# EAGLE design DispenGSM (EAGLE 9.6.2)
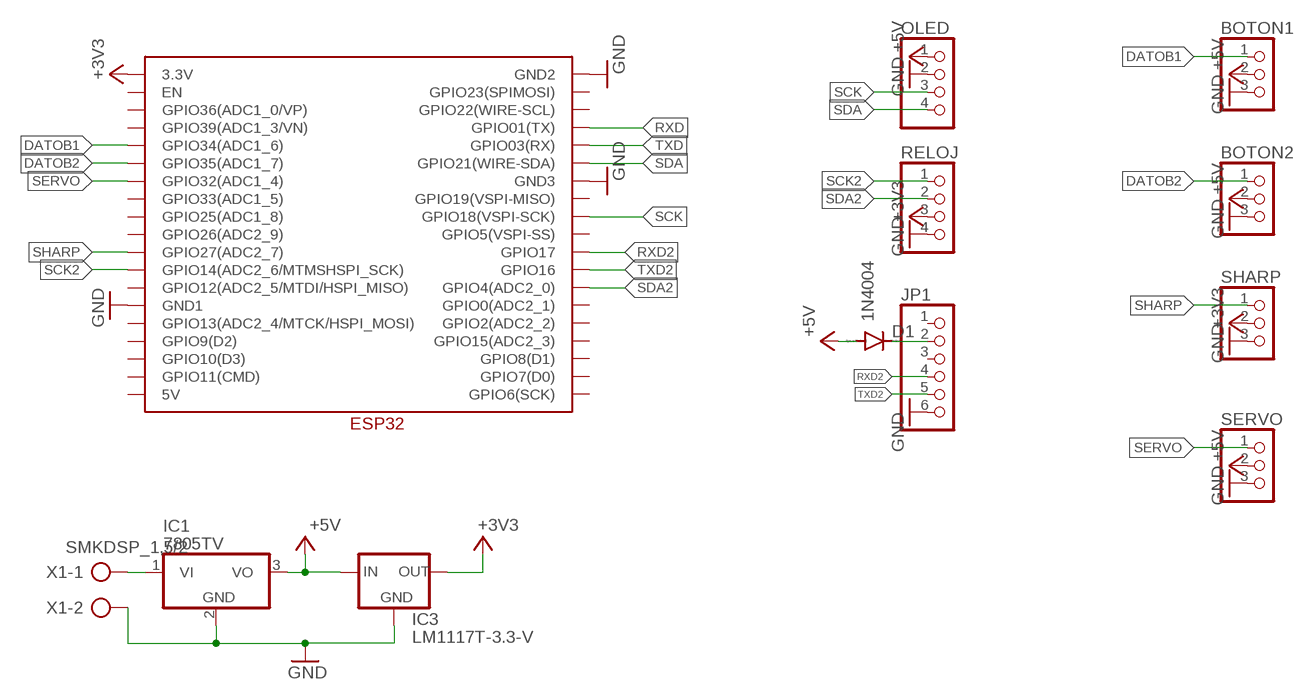
[diagram p0: schematic, sheet 1]

## Parts
BOTON1  PINHD-1X3  [1X03]
BOTON2  PINHD-1X3  [1X03]
D1  1N4004  [DO41-10]
IC1  7805TV  [TO220V]
IC3  LM1117T-3.3-V  [TO220V]
JP1  PINHD-1X6  [1X06]
OLED  PINHD-1X4  [1X04]
RELOJ  PINHD-1X4  [1X04]
SERVO  PINHD-1X3  [1X03]
SHARP  PINHD-1X3  [1X03]
U$1  ESP32WESP32W  [ESP32W]
X1  SMKDSP_1,5/2  [SMKDSP_1,5/2]

## Nets
+3V3: IC3.2(OUT) RELOJ.3 SHARP.2 U$1.3.3V
+5V: BOTON1.2 BOTON2.2 D1.A IC1.3(VO) IC3.3(IN) OLED.1 SERVO.2
DATOB1: BOTON1.1 U$1.GPIO34(GPIO34(ADC1_6))
DATOB2: BOTON2.1 U$1.GPIO35(GPIO35(ADC1_7))
GND: BOTON1.3 BOTON2.3 IC1.2(GND) IC3.1(GND) JP1.6 OLED.2 RELOJ.4 SERVO.3 SHARP.3 U$1.GND1 U$1.GND2 U$1.GND3 X1.2
N$1: IC1.1(VI) X1.1
N$2: D1.C JP1.2
RXD: U$1.TX(GPIO01(TX))
RXD2: JP1.4 U$1.GPIO17
SCK: OLED.3 U$1.GPIO18(GPIO18(VSPI-SCK))
SCK2: RELOJ.1 U$1.GPIO14(GPIO14(ADC2_6/MTMSHSPI_SCK))
SDA: OLED.4 U$1.GPIO21(GPIO21(WIRE-SDA))
SDA2: RELOJ.2 U$1.GPIO4(GPIO4(ADC2_0))
SERVO: SERVO.1 U$1.GPIO32(GPIO32(ADC1_4))
SHARP: SHARP.1 U$1.GPIO27(GPIO27(ADC2_7))
TXD: U$1.RX(GPIO03(RX))
TXD2: JP1.5 U$1.GPIO16
Unconnected: JP1.1 JP1.3 U$1.5V U$1.CLK(GPIO6(SCK)) U$1.CMD(GPIO11(CMD)) U$1.D2(GPIO9(D2)) U$1.D3(GPIO10(D3)) U$1.EN U$1.GPIO0(GPIO0(ADC2_1)) U$1.GPIO2(GPIO2(ADC2_2)) U$1.GPIO5(GPIO5(VSPI-SS)) U$1.GPIO12(GPIO12(ADC2_5/MTDI/HSPI_MISO)) U$1.GPIO13(GPIO13(ADC2_4/MTCK/HSPI_MOSI)) U$1.GPIO15(GPIO15(ADC2_3)) U$1.GPIO19(GPIO19(VSPI-MISO)) U$1.GPIO22(GPIO22(WIRE-SCL)) U$1.GPIO23(GPIO23(SPIMOSI)) U$1.GPIO25(GPIO25(ADC1_8)) U$1.GPIO26(GPIO26(ADC2_9)) U$1.GPIO33(GPIO33(ADC1_5)) U$1.SDI(GPIO8(D1)) U$1.SDO(GPIO7(D0)) U$1.VN(GPIO39(ADC1_3/VN)) U$1.VP(GPIO36(ADC1_0/VP))

## Library data of the parts
BOTON1 BOTON2 SERVO SHARP = pinhead:PINHD-1X3: PIN HEADER
D1 = diode:1N4004: DIODE general purpose rectifier, 1 A
IC1 = linear:78*: Positive VOLTAGE REGULATOR Source: http://cache.national.com/ds/LM/LM78L05.pdf http://www.fairchildsemi.com/ds/LM/LM7805.pdf
IC3 = lm1117:LM1117T-*
JP1 = pinhead:PINHD-1X6: PIN HEADER
OLED RELOJ = pinhead:PINHD-1X4: PIN HEADER
U$1 = ESP32-WROOM2:ESP32W
X1 = con-phoenix-smkdsp:SMKDSP_1,5/2: Printklemme, Nennstrom: 17,5 A, Bemessungsspannung: 250 V, Raster: 5,0 mm Source: http://eshop.phoenixcontact.de .. 1733415.pdf; MF: FARNELL; MPN: 1733570; OC_FARNELL: 3041244; OC_NEWARK: 69C8588

## Board
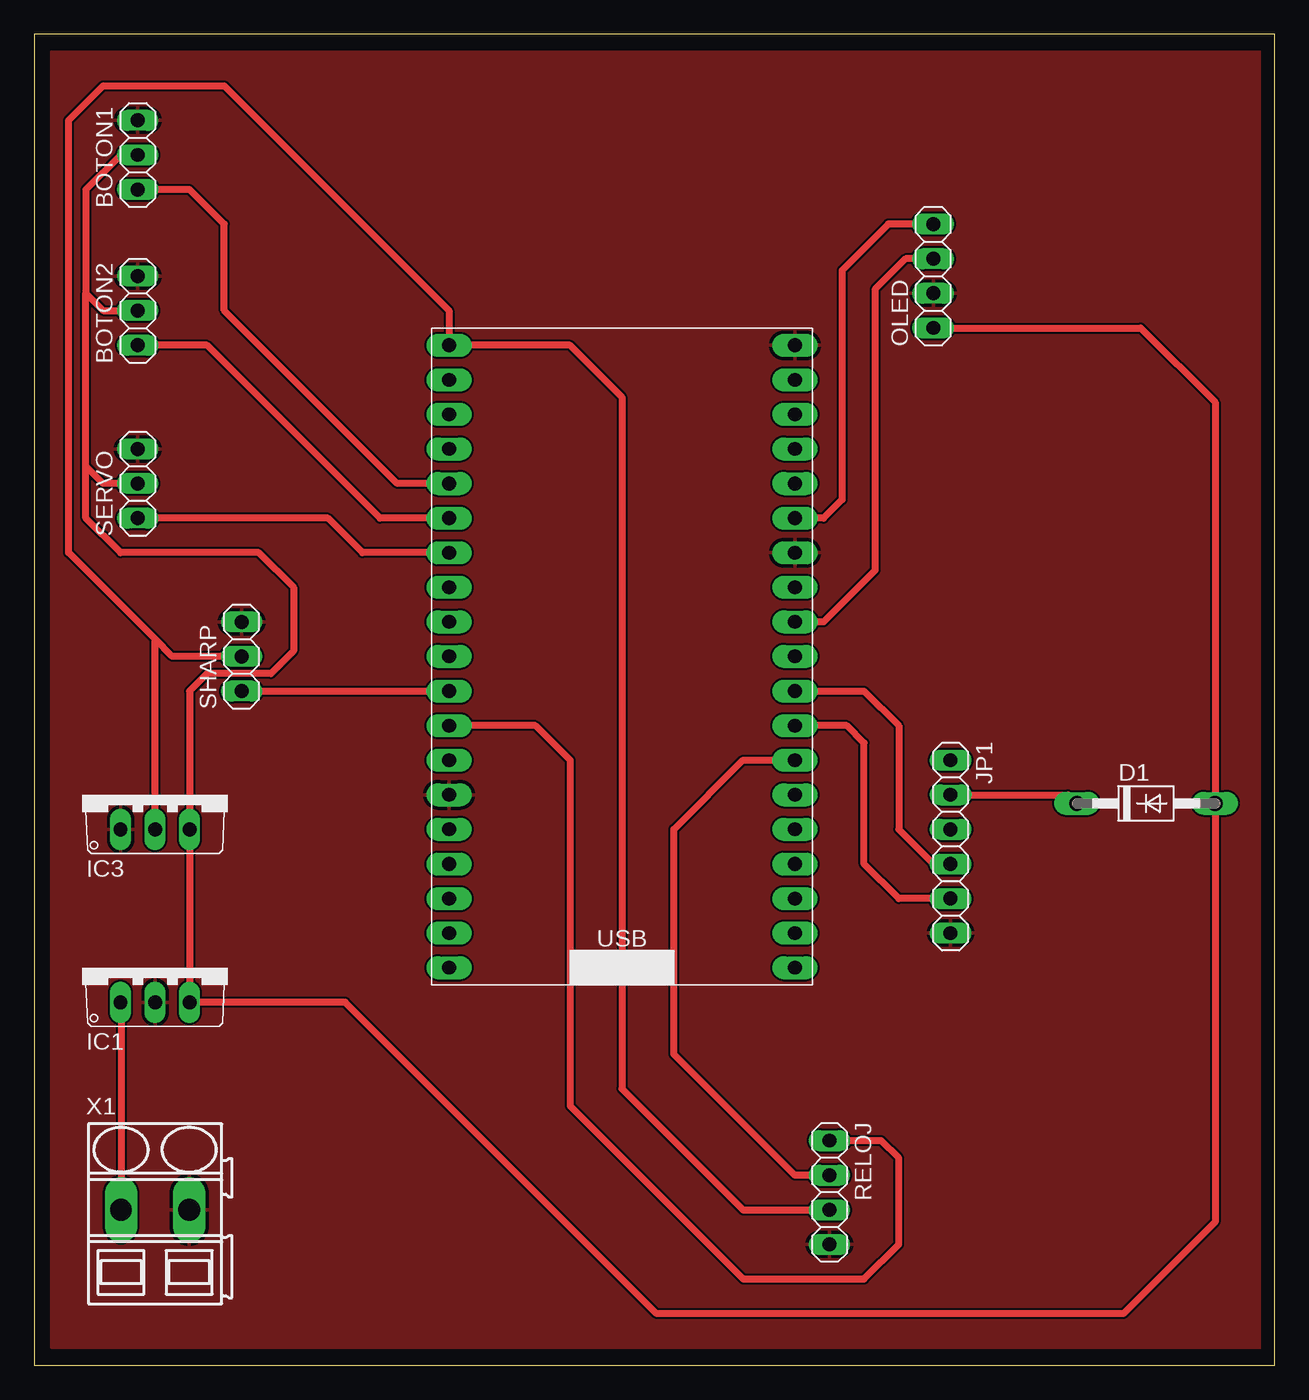
[diagram p1: board, top side]

Size 91.11 x 97.78 mm. Coordinates in mm from the lower left corner, seen from the top.
Outline: 0,0 91.11,0 91.11,97.78 0,97.78 0,0
Copper layers (1*16): Top 0.035mm / dielectric 1.5mm / Bottom 0.035mm
Design rules "default *": minimum track width 20mil, minimum drill 0.9mm, track to track 6mil, track to pad 10mil, pad to pad 10mil, via to via 10mil, smd to smd 6mil, copper to edge 40mil, drill to drill 6mil, minimum pad ring 10mil, minimum via ring 8mil, stop-mask expansion 4mil, vias tented up to drill 0mil, thermal gap 10mil

### Footprints (pad centres in the part's own frame; a part is rotated, then mirrored left to right if it is on the bottom)
1X03 = drill 1.016 long: 1 -2.54,0; 2 0,0; 3 2.54,0
DO41-10 = drill 1.118 long: A 5.08,0; C -5.08,0
TO220V = drill 1.016 long: 1 -2.54,-2.54; 2 0,-2.54; 3 2.54,-2.54
1X06 = drill 1.016 long: 1 -6.35,0; 2 -3.81,0; 3 -1.27,0; 4 1.27,0; 5 3.81,0; 6 6.35,0
1X04 = drill 1.016 long: 1 -3.81,0; 2 -1.27,0; 3 1.27,0; 4 3.81,0
ESP32W = drill 1 pad 1.676 long: 3.3V 1.27,46.99; 5V 1.27,1.27; CLK 26.67,1.27; CMD 1.27,3.81; D2 1.27,8.89; D3 1.27,6.35; EN 1.27,44.45; GND1 1.27,13.97; GND2 26.67,46.99; GND3 26.67,31.75; GPIO0 26.67,13.97; GPIO2 26.67,11.43; GPIO4 26.67,16.51; GPIO5 26.67,24.13; GPIO12 1.27,16.51; GPIO13 1.27,11.43; GPIO14 1.27,19.05; GPIO15 26.67,8.89; GPIO16 26.67,19.05; GPIO17 26.67,21.59; GPIO18 26.67,26.67; GPIO19 26.67,29.21; GPIO21 26.67,34.29; GPIO22 26.67,41.91; GPIO23 26.67,44.45; GPIO25 1.27,26.67; GPIO26 1.27,24.13; GPIO27 1.27,21.59; GPIO32 1.27,31.75; GPIO33 1.27,29.21; GPIO34 1.27,36.83; GPIO35 1.27,34.29; RX 26.67,36.83; SDI 26.67,6.35; SDO 26.67,3.81; TX 26.67,39.37; VN 1.27,39.37; VP 1.27,41.91
SMKDSP_1,5/2 = drill 1.6 pad 1.8 long: 1 -2.5,0; 2 2.5,0

### Placement (x,y rotation side)
BOTON1  7.62,88.9 90 top
BOTON2  7.62,77.47 90 top
D1  81.66,41.27 0 top
IC1  8.89,29.21 0 top
IC3  8.89,41.91 0 top
JP1  67.31,38.1 270 top
OLED  66.04,80.01 90 top
RELOJ  58.42,12.7 270 top
SERVO  7.62,64.77 90 top
SHARP  15.24,52.07 90 top
U$1  29.21,27.94 0 top
X1  8.89,11.43 0 top

### Tracks (layer width: path | path; a pad name or v marks a point on that pad's centre or on a via)
+3V3
  Top 0.508: 8.89,53.34 2.54,59.69 2.54,91.44 5.08,93.98 13.97,93.98 30.48,77.47 U$1.3.3V 39.37,74.93 43.18,71.12 43.18,20.32 52.07,11.43 RELOJ.3 | SHARP.2 10.16,52.07 8.89,53.34 | IC3.2 8.89,53.34
+5V
  Top 0.508: BOTON1.2 6.35,88.9 3.81,86.36 3.81,78.74 | 3.81,78.74 5.08,77.47 BOTON2.2 | SERVO.2 5.08,64.77 3.81,66.04 | 3.81,66.04 3.81,78.74 | 3.81,66.04 3.81,62.23 6.35,59.69 16.51,59.69 19.05,57.15 19.05,52.45 17.4,50.8 12.7,50.8 11.43,49.53 IC3.3 IC1.3 22.86,26.67 45.72,3.81 80.01,3.81 86.74,10.54 D1.A 86.74,70.74 81.28,76.2 OLED.1
DATOB1
  Top 0.508: U$1.GPIO34 26.67,64.77 13.97,77.47 13.97,83.82 11.43,86.36 BOTON1.1
DATOB2
  Top 0.508: U$1.GPIO35 25.4,62.23 12.7,74.93 BOTON2.1
GND
  pour Top: 1.27,1.27 1.27,96.52 90.17,96.52 90.17,1.27
N$1
  Top 0.508: IC1.1 6.39,26.63 X1.1
N$2
  Top 0.508: JP1.2 75.95,41.91 D1.C
RXD2
  Top 0.508: U$1.GPIO17 60.96,49.53 63.5,46.99 63.5,39.37 66.04,36.83 JP1.4
SCK
  Top 0.508: OLED.3 64.01,81.28 61.76,79.03 61.76,58.38 57.99,54.61 U$1.GPIO18
SCK2
  Top 0.508: U$1.GPIO14 36.83,46.99 39.37,44.45 39.37,19.05 52.07,6.35 60.96,6.35 63.5,8.89 63.5,15.24 62.23,16.51 RELOJ.1
SDA
  Top 0.508: OLED.4 62.74,83.82 59.33,80.42 59.33,63.58 57.99,62.23 U$1.GPIO21
SDA2
  Top 0.508: U$1.GPIO4 52.07,44.45 46.99,39.37 46.99,22.86 55.88,13.97 RELOJ.2
SERVO
  Top 0.508: U$1.GPIO32 24.13,59.69 21.59,62.23 SERVO.1
SHARP
  Top 0.508: SHARP.1 U$1.GPIO27
TXD2
  Top 0.508: JP1.5 63.5,34.29 60.96,36.83 60.96,45.72 59.69,46.99 U$1.GPIO16